# Altium schematic sheet Crosspoint_control.SchDoc: Cross-point control
size A3; Author: M.Beldyga; CompanyName: WUT ISE; DrawnBy: M.Beldyga; Organization: WUT ISE; Address1: PW ISE; Address2: Nowowiejska 15/19 00-665 Warsaw; Address3: micbeldyga@gmail.com; SheetNumber: 5; SheetTotal: 8; ModifiedBy: -; CheckedDate: -; DivGrp: WUT ISE; Designer: M.Beldyga; ModifiedDate: -; ProjectName: Sensor Box
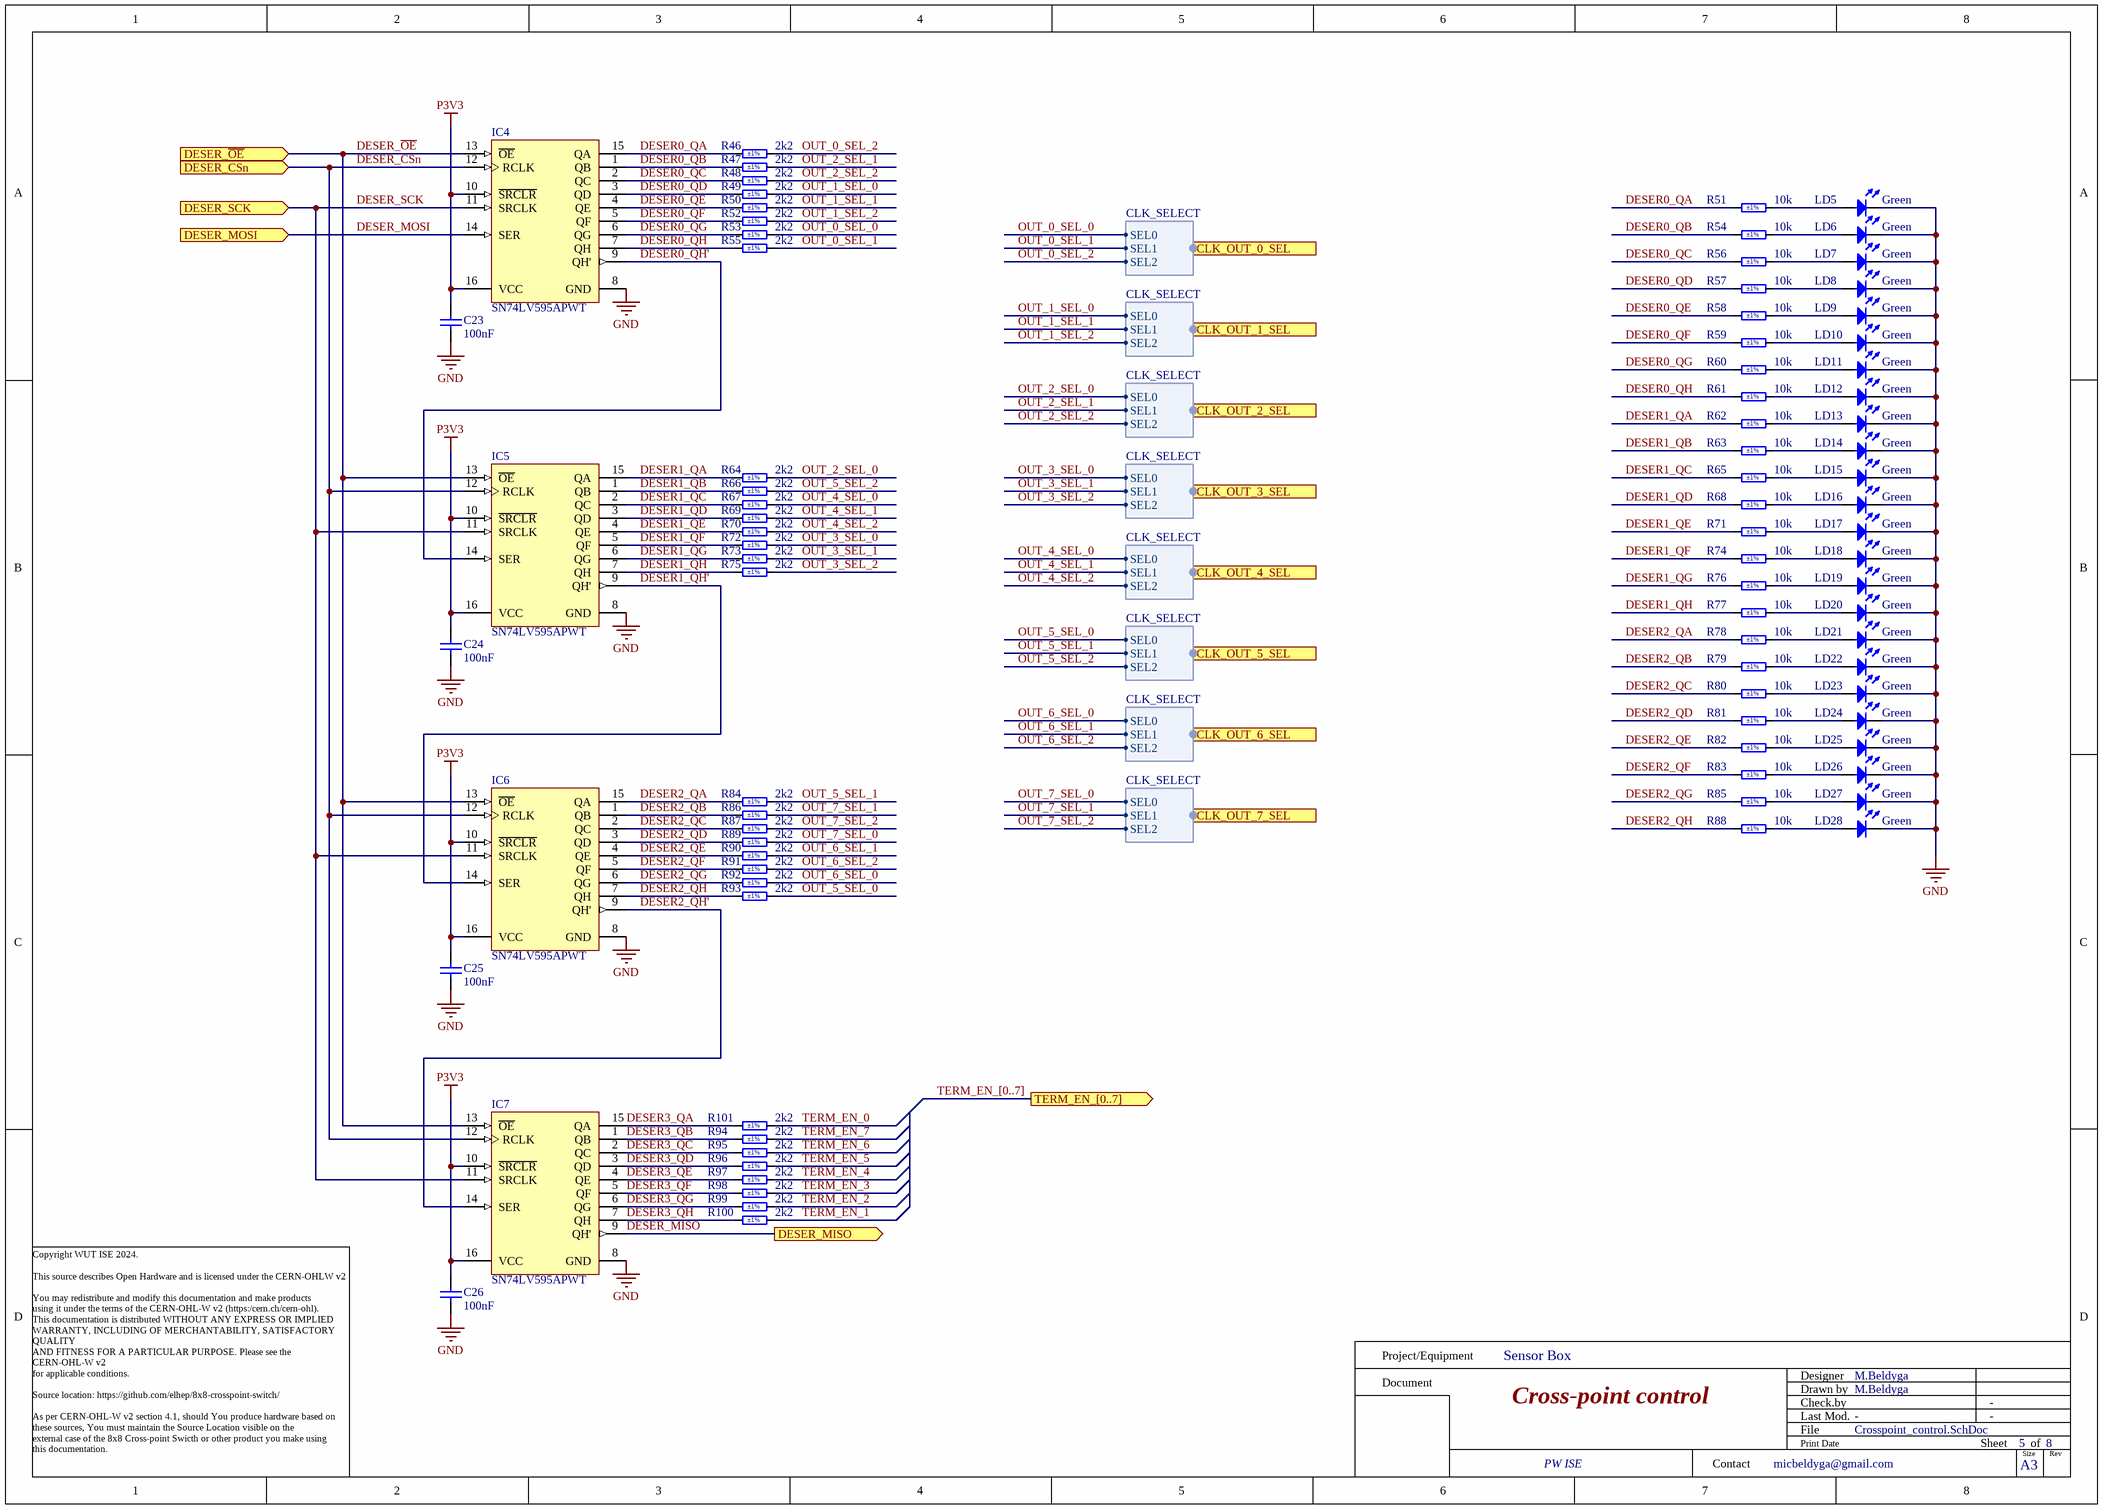
[diagram p0: Crosspoint_control.SchDoc]

## Parts
C23  100nF  [CAPC1005X55N]
C24  100nF  [CAPC1005X55N]
C25  100nF  [CAPC1005X55N]
C26  100nF  [CAPC1005X55N]
IC4  SN74LV595APWT  [SOP65P640X120-16N]
IC5  SN74LV595APWT  [SOP65P640X120-16N]
IC6  SN74LV595APWT  [SOP65P640X120-16N]
IC7  SN74LV595APWT  [SOP65P640X120-16N]
LD5  Green  [LED_KINGBRIGHT_KP-1608CGCK]
LD6  Green  [LED_KINGBRIGHT_KP-1608CGCK]
LD7  Green  [LED_KINGBRIGHT_KP-1608CGCK]
LD8  Green  [LED_KINGBRIGHT_KP-1608CGCK]
LD9  Green  [LED_KINGBRIGHT_KP-1608CGCK]
LD10  Green  [LED_KINGBRIGHT_KP-1608CGCK]
LD11  Green  [LED_KINGBRIGHT_KP-1608CGCK]
LD12  Green  [LED_KINGBRIGHT_KP-1608CGCK]
LD13  Green  [LED_KINGBRIGHT_KP-1608CGCK]
LD14  Green  [LED_KINGBRIGHT_KP-1608CGCK]
LD15  Green  [LED_KINGBRIGHT_KP-1608CGCK]
LD16  Green  [LED_KINGBRIGHT_KP-1608CGCK]
LD17  Green  [LED_KINGBRIGHT_KP-1608CGCK]
LD18  Green  [LED_KINGBRIGHT_KP-1608CGCK]
LD19  Green  [LED_KINGBRIGHT_KP-1608CGCK]
LD20  Green  [LED_KINGBRIGHT_KP-1608CGCK]
LD21  Green  [LED_KINGBRIGHT_KP-1608CGCK]
LD22  Green  [LED_KINGBRIGHT_KP-1608CGCK]
LD23  Green  [LED_KINGBRIGHT_KP-1608CGCK]
LD24  Green  [LED_KINGBRIGHT_KP-1608CGCK]
LD25  Green  [LED_KINGBRIGHT_KP-1608CGCK]
LD26  Green  [LED_KINGBRIGHT_KP-1608CGCK]
LD27  Green  [LED_KINGBRIGHT_KP-1608CGCK]
LD28  Green  [LED_KINGBRIGHT_KP-1608CGCK]
R46  2k2  Tolerance: ±1%  [RESC1005X40N]
R47  2k2  Tolerance: ±1%  [RESC1005X40N]
R48  2k2  Tolerance: ±1%  [RESC1005X40N]
R49  2k2  Tolerance: ±1%  [RESC1005X40N]
R50  2k2  Tolerance: ±1%  [RESC1005X40N]
R51  10k  Tolerance: ±1%  [RESC1005X40N]
R52  2k2  Tolerance: ±1%  [RESC1005X40N]
R53  2k2  Tolerance: ±1%  [RESC1005X40N]
R54  10k  Tolerance: ±1%  [RESC1005X40N]
R55  2k2  Tolerance: ±1%  [RESC1005X40N]
R56  10k  Tolerance: ±1%  [RESC1005X40N]
R57  10k  Tolerance: ±1%  [RESC1005X40N]
R58  10k  Tolerance: ±1%  [RESC1005X40N]
R59  10k  Tolerance: ±1%  [RESC1005X40N]
R60  10k  Tolerance: ±1%  [RESC1005X40N]
R61  10k  Tolerance: ±1%  [RESC1005X40N]
R62  10k  Tolerance: ±1%  [RESC1005X40N]
R63  10k  Tolerance: ±1%  [RESC1005X40N]
R64  2k2  Tolerance: ±1%  [RESC1005X40N]
R65  10k  Tolerance: ±1%  [RESC1005X40N]
R66  2k2  Tolerance: ±1%  [RESC1005X40N]
R67  2k2  Tolerance: ±1%  [RESC1005X40N]
R68  10k  Tolerance: ±1%  [RESC1005X40N]
R69  2k2  Tolerance: ±1%  [RESC1005X40N]
R70  2k2  Tolerance: ±1%  [RESC1005X40N]
R71  10k  Tolerance: ±1%  [RESC1005X40N]
R72  2k2  Tolerance: ±1%  [RESC1005X40N]
R73  2k2  Tolerance: ±1%  [RESC1005X40N]
R74  10k  Tolerance: ±1%  [RESC1005X40N]
R75  2k2  Tolerance: ±1%  [RESC1005X40N]
R76  10k  Tolerance: ±1%  [RESC1005X40N]
R77  10k  Tolerance: ±1%  [RESC1005X40N]
R78  10k  Tolerance: ±1%  [RESC1005X40N]
R79  10k  Tolerance: ±1%  [RESC1005X40N]
R80  10k  Tolerance: ±1%  [RESC1005X40N]
R81  10k  Tolerance: ±1%  [RESC1005X40N]
R82  10k  Tolerance: ±1%  [RESC1005X40N]
R83  10k  Tolerance: ±1%  [RESC1005X40N]
R84  2k2  Tolerance: ±1%  [RESC1005X40N]
R85  10k  Tolerance: ±1%  [RESC1005X40N]
R86  2k2  Tolerance: ±1%  [RESC1005X40N]
R87  2k2  Tolerance: ±1%  [RESC1005X40N]
R88  10k  Tolerance: ±1%  [RESC1005X40N]
R89  2k2  Tolerance: ±1%  [RESC1005X40N]
R90  2k2  Tolerance: ±1%  [RESC1005X40N]
R91  2k2  Tolerance: ±1%  [RESC1005X40N]
R92  2k2  Tolerance: ±1%  [RESC1005X40N]
R93  2k2  Tolerance: ±1%  [RESC1005X40N]
R94  2k2  Tolerance: ±1%  [RESC1005X40N]
R95  2k2  Tolerance: ±1%  [RESC1005X40N]
R96  2k2  Tolerance: ±1%  [RESC1005X40N]
R97  2k2  Tolerance: ±1%  [RESC1005X40N]
R98  2k2  Tolerance: ±1%  [RESC1005X40N]
R99  2k2  Tolerance: ±1%  [RESC1005X40N]
R100  2k2  Tolerance: ±1%  [RESC1005X40N]
R101  2k2  Tolerance: ±1%  [RESC1005X40N]

## Ports
CLK_OUT_0_SEL (out, harness CLK_SELECT), CLK_OUT_1_SEL (out, harness CLK_SELECT), CLK_OUT_2_SEL (out, harness CLK_SELECT), CLK_OUT_3_SEL (out, harness CLK_SELECT), CLK_OUT_4_SEL (out, harness CLK_SELECT), CLK_OUT_5_SEL (out, harness CLK_SELECT), CLK_OUT_6_SEL (out, harness CLK_SELECT), CLK_OUT_7_SEL (out, harness CLK_SELECT), DESER_CSn (in), DESER_MISO (out), DESER_MOSI (in), DESER_SCK (in), DESER_~{OE} (in), TERM_EN_[0..7] (out)

## Harnesses
CLK_SELECT: SEL0, SEL1, SEL2

## Nets
GND: C23.1 C24.1 C25.1 C26.1 IC4.8(GND) IC5.8(GND) IC6.8(GND) IC7.8(GND) LD5.1(C) LD6.1(C) LD7.1(C) LD8.1(C) LD9.1(C) LD10.1(C) LD11.1(C) LD12.1(C) LD13.1(C) LD14.1(C) LD15.1(C) LD16.1(C) LD17.1(C) LD18.1(C) LD19.1(C) LD20.1(C) LD21.1(C) LD22.1(C) LD23.1(C) LD24.1(C) LD25.1(C) LD26.1(C) LD27.1(C) LD28.1(C)
P3V3: C23.2 C24.2 C25.2 C26.2 IC4.10(~{SRCLR}) IC4.16(VCC) IC5.10(~{SRCLR}) IC5.16(VCC) IC6.10(~{SRCLR}) IC6.16(VCC) IC7.10(~{SRCLR}) IC7.16(VCC)
DESER0_QA: IC4.15(QA) R46.1 R51.2
DESER0_QB: IC4.1(QB) R47.1 R54.2
DESER0_QC: IC4.2(QC) R48.1 R56.2
DESER0_QD: IC4.3(QD) R49.1 R57.2
DESER0_QE: IC4.4(QE) R50.1 R58.2
DESER0_QF: IC4.5(QF) R52.1 R59.2
DESER0_QG: IC4.6(QG) R53.1 R60.2
DESER0_QH: IC4.7(QH) R55.1 R61.2
DESER0_QH': IC4.9(QH') IC5.14(SER)
DESER1_QA: IC5.15(QA) R62.2 R64.1
DESER1_QB: IC5.1(QB) R63.2 R66.1
DESER1_QC: IC5.2(QC) R65.2 R67.1
DESER1_QD: IC5.3(QD) R68.2 R69.1
DESER1_QE: IC5.4(QE) R70.1 R71.2
DESER1_QF: IC5.5(QF) R72.1 R74.2
DESER1_QG: IC5.6(QG) R73.1 R76.2
DESER1_QH: IC5.7(QH) R75.1 R77.2
DESER1_QH': IC5.9(QH') IC6.14(SER)
DESER2_QA: IC6.15(QA) R78.2 R84.1
DESER2_QB: IC6.1(QB) R79.2 R86.1
DESER2_QC: IC6.2(QC) R80.2 R87.1
DESER2_QD: IC6.3(QD) R81.2 R89.1
DESER2_QE: IC6.4(QE) R82.2 R90.1
DESER2_QF: IC6.5(QF) R83.2 R91.1
DESER2_QG: IC6.6(QG) R85.2 R92.1
DESER2_QH: IC6.7(QH) R88.2 R93.1
DESER2_QH': IC6.9(QH') IC7.14(SER)
DESER3_QA: IC7.15(QA) R101.1
DESER3_QB: IC7.1(QB) R94.1
DESER3_QC: IC7.2(QC) R95.1
DESER3_QD: IC7.3(QD) R96.1
DESER3_QE: IC7.4(QE) R97.1
DESER3_QF: IC7.5(QF) R98.1
DESER3_QG: IC7.6(QG) R99.1
DESER3_QH: IC7.7(QH) R100.1
DESER_CSn: IC4.12(RCLK) IC5.12(RCLK) IC6.12(RCLK) IC7.12(RCLK) ; port DESER_CSn
DESER_MISO: IC7.9(QH') ; port DESER_MISO
DESER_MOSI: IC4.14(SER) ; port DESER_MOSI
DESER_~{OE}: IC4.13(~{OE}) IC5.13(~{OE}) IC6.13(~{OE}) IC7.13(~{OE}) ; port DESER_~{OE}
DESER_SCK: IC4.11(SRCLK) IC5.11(SRCLK) IC6.11(SRCLK) IC7.11(SRCLK) ; port DESER_SCK
OUT_0_SEL_0: R53.2 ; port CLK_OUT_0_SEL.SEL0
OUT_0_SEL_1: R55.2 ; port CLK_OUT_0_SEL.SEL1
OUT_0_SEL_2: R46.2 ; port CLK_OUT_0_SEL.SEL2
OUT_1_SEL_0: R49.2 ; port CLK_OUT_1_SEL.SEL0
OUT_1_SEL_1: R50.2 ; port CLK_OUT_1_SEL.SEL1
OUT_1_SEL_2: R52.2 ; port CLK_OUT_1_SEL.SEL2
OUT_2_SEL_0: R64.2 ; port CLK_OUT_2_SEL.SEL0
OUT_2_SEL_1: R47.2 ; port CLK_OUT_2_SEL.SEL1
OUT_2_SEL_2: R48.2 ; port CLK_OUT_2_SEL.SEL2
OUT_3_SEL_0: R72.2 ; port CLK_OUT_3_SEL.SEL0
OUT_3_SEL_1: R73.2 ; port CLK_OUT_3_SEL.SEL1
OUT_3_SEL_2: R75.2 ; port CLK_OUT_3_SEL.SEL2
OUT_4_SEL_0: R67.2 ; port CLK_OUT_4_SEL.SEL0
OUT_4_SEL_1: R69.2 ; port CLK_OUT_4_SEL.SEL1
OUT_4_SEL_2: R70.2 ; port CLK_OUT_4_SEL.SEL2
OUT_5_SEL_0: R93.2 ; port CLK_OUT_5_SEL.SEL0
OUT_5_SEL_1: R84.2 ; port CLK_OUT_5_SEL.SEL1
OUT_5_SEL_2: R66.2 ; port CLK_OUT_5_SEL.SEL2
OUT_6_SEL_0: R92.2 ; port CLK_OUT_6_SEL.SEL0
OUT_6_SEL_1: R90.2 ; port CLK_OUT_6_SEL.SEL1
OUT_6_SEL_2: R91.2 ; port CLK_OUT_6_SEL.SEL2
OUT_7_SEL_0: R89.2 ; port CLK_OUT_7_SEL.SEL0
OUT_7_SEL_1: R86.2 ; port CLK_OUT_7_SEL.SEL1
OUT_7_SEL_2: R87.2 ; port CLK_OUT_7_SEL.SEL2
TERM_EN_0: R101.2
TERM_EN_1: R100.2
TERM_EN_2: R99.2
TERM_EN_3: R98.2
TERM_EN_4: R97.2
TERM_EN_5: R96.2
TERM_EN_6: R95.2
TERM_EN_7: R94.2
NetLD5_2: LD5.2(A) R51.1
NetLD6_2: LD6.2(A) R54.1
NetLD7_2: LD7.2(A) R56.1
NetLD8_2: LD8.2(A) R57.1
NetLD9_2: LD9.2(A) R58.1
NetLD10_2: LD10.2(A) R59.1
NetLD11_2: LD11.2(A) R60.1
NetLD12_2: LD12.2(A) R61.1
NetLD13_2: LD13.2(A) R62.1
NetLD14_2: LD14.2(A) R63.1
NetLD15_2: LD15.2(A) R65.1
NetLD16_2: LD16.2(A) R68.1
NetLD17_2: LD17.2(A) R71.1
NetLD18_2: LD18.2(A) R74.1
NetLD19_2: LD19.2(A) R76.1
NetLD20_2: LD20.2(A) R77.1
NetLD21_2: LD21.2(A) R78.1
NetLD22_2: LD22.2(A) R79.1
NetLD23_2: LD23.2(A) R80.1
NetLD24_2: LD24.2(A) R81.1
NetLD25_2: LD25.2(A) R82.1
NetLD26_2: LD26.2(A) R83.1
NetLD27_2: LD27.2(A) R85.1
NetLD28_2: LD28.2(A) R88.1

## Buses and harness runs
bus TERM_EN_[0..7] = port TERM_EN_[0..7]

## Notes on the sheet
- Copyright WUT ISE 2024.
  This source describes Open Hardware and is licensed under the CERN-OHLW v2
  You may redistribute and modify this documentation and make products
  using it under the terms of the CERN-OHL-W v2 (https:/cern.ch/cern-ohl).
  This documentation is distributed WITHOUT ANY EXPRESS OR IMPLIED
  WARRANTY, INCLUDING OF MERCHANTABILITY, SATISFACTORY QUALITY
  AND FITNESS FOR A PARTICULAR PURPOSE. Please see the CERN-OHL-W v2
  for applicable conditions.
  Source location: https://github.com/elhep/8x8-crosspoint-switch/
  As per CERN-OHL-W v2 section 4.1, should You produce hardware based on
  these sources, You must maintain the Source Location visible on the
  external case of the 8x8 Cross-point Swicth or other product you make using
  this documentation.
- Project/Equipment
- Document
- Designer
- Drawn by
- Check.by
- Contact
- File
- Last Mod.
- Print Date
- Sheet
- Size
- A3
- of
- Rev

## Library data of the parts
C23-C26 = CC0402_100NF_50V_10%_X7R: Non-polarised capacitor; Part Description: SMD Multilayer Chip Ceramic Capacitor; Manufacturer: GENERIC; Manufacturer1 Part Number: GRM155R71H104KE14D; Voltage: 50V; TC: X7R; Tolerance: ±10%; Part Number: CC0402_100NF_50V_10%_X7R; Component Kind: Standard; Component Type: Standard; Pin Count: 2; Value: 100nF; Status: None; Manufacturer Part Number: CC0402_100NF_50V_10%_X7R; Case: 0402; Mounted: Yes; Socket: No; SMD: Yes; Sense: No; Manufacturer1 Example: MURATA; Manufacturer1 ComponentHeight: 0.55mm; HelpURL: \\cern.ch\dfs\Applications\Altium\Datasheets\CC0402_MURATA_GRM155R71H104KE14D.pdf; Author: CERN DEM MR; CreateDate: 6/30/2017; LatestRevisionDate: 6/30/2017
IC4-IC7 = SN74LV595APWT: 8-Bit Shift Register With 3-State Output Register; Part Description: 8-Bit Shift Register with 3-State Output Registers; Manufacturer: TEXAS INSTRUMENTS; PressFit: No; Bonding: No; Part Number: SN74LV595APWT; Component Kind: Standard; Component Type: Standard; Device: SN74LV595APWT; PackageDescription: SOP, 0.65mm Pitch; 16 Pin, 4.40mm W X 5.00mm L X 1.20mm H body, IPC Medium Density; Manufacturer Part Number: SN74LV595APWT; Pin Count: 16; Case: TSSOP16; Mounted: Yes; Socket: No; SMD: Yes; Sense: No; ComponentHeight: 1.2mm; Author: CERN DEM JLC; HelpURL: \\cern.ch\dfs\Applications\Altium\Datasheets\SN74LV595APWT.pdf; CreateDate: 5/10/2012; LatestRevisionDate: 5/10/2012
LD5-LD28 = LED_KINGBRIGHT_KP-1608CGCK: LED Green 1C 2A; Part Description: 1.6x0.8mm SMD Chip Green LED Lamp; PressFit: No; Bonding: No; Part Number: LED_KINGBRIGHT_KP-1608CGCK; Component Kind: Standard; Component Type: Standard; Color: Green; PackageDescription: SMT Green LED, Case 0603, Body L 1.60mm x W 0.80mm x H 1.10mm; Manufacturer: KINGBRIGHT; Manufacturer Part Number: KP-1608CGCK; Pin Count: 2; Case: 0603; Mounted: Yes; Socket: No; SMD: Yes; Sense: No; ComponentHeight: 1.1mm; HelpURL: \\cern.ch\dfs\Applications\Altium\Datasheets\LED_KINGBRIGHT_KP-1608CGCK.pdf; Author: CERN DEM HF; CreateDate: 10/1/2021; LatestRevisionDate: 10/1/2021
R46-R50 R52 R53 R55 R64 R66 R67 R69 R70 R72 R73 R75 R84 R86 R87 R89-R101 = R0402_2K2_1%_0.0625W_100PPM: Resistor - 1%; Part Description: General Purpose Thick Film Chip Resistor; Manufacturer: GENERIC; Manufacturer1 Part Number: 232270672202L; TC: ±100ppm/°C; PressFit: No; Part Number: R0402_2K2_1%_0.0625W_100PPM; Component Kind: Standard; Component Type: Standard; Pin Count: 2; Value: 2k2; Status: Not Recommended; Power: 0.0625W; Manufacturer Part Number: R0402_2K2_1%_0.0625W_100PPM; Case: 0402; Mounted: Yes; Sense: No; Socket: No; SMD: Yes; Manufacturer1 Example: YAGEO PHYCOMP; Manufacturer1 ComponentHeight: 0.4mm; HelpURL: \\cern.ch\dfs\Applications\Altium\Datasheets\R0402_Phycomp_RC0402.pdf; Author: CERN DEM JLC; CreateDate: 12/3/2007; LatestRevisionDate: 10/17/2012
R51 R54 R56-R63 R65 R68 R71 R74 R76-R83 R85 R88 = R0402_10K_1%_0.0625W_100PPM: Resistor - 1%; Part Description: General Purpose Thick Film Chip Resistor; Manufacturer: GENERIC; Manufacturer1 Part Number: 232270671003L; TC: ±100ppm/°C; PressFit: No; Part Number: R0402_10K_1%_0.0625W_100PPM; Component Kind: Standard; Component Type: Standard; Pin Count: 2; Value: 10k; Status: Not Recommended; Power: 0.0625W; Manufacturer Part Number: R0402_10K_1%_0.0625W_100PPM; Case: 0402; Mounted: Yes; Sense: No; Socket: No; SMD: Yes; Manufacturer1 Example: YAGEO PHYCOMP; Manufacturer1 ComponentHeight: 0.4mm; HelpURL: \\cern.ch\dfs\Applications\Altium\Datasheets\R0402_Phycomp_RC0402.pdf; Author: CERN DEM JLC; CreateDate: 12/3/2007; LatestRevisionDate: 10/17/2012